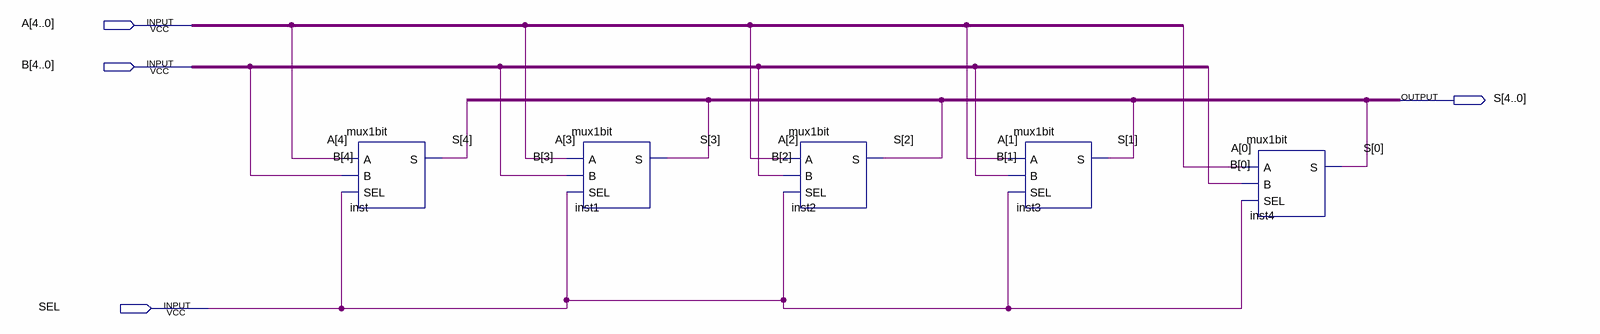
[diagram p0: schematic sheet]
// Quartus schematic mux5bit.bdf as structural Verilog: 5 symbols, 4 pins
module mux5bit (
  input  [4:0] A,
  input  [4:0] B,
  input  SEL,
  output [4:0] S
);

  mux1bit inst (.A(A[4]), .B(B[4]), .SEL(SEL), .S(S[4]));
  mux1bit inst1 (.A(A[3]), .B(B[3]), .SEL(SEL), .S(S[3]));
  mux1bit inst2 (.A(A[2]), .B(B[2]), .SEL(SEL), .S(S[2]));
  mux1bit inst3 (.A(A[1]), .B(B[1]), .SEL(SEL), .S(S[1]));
  mux1bit inst4 (.A(A[0]), .B(B[0]), .SEL(SEL), .S(S[0]));
endmodule
